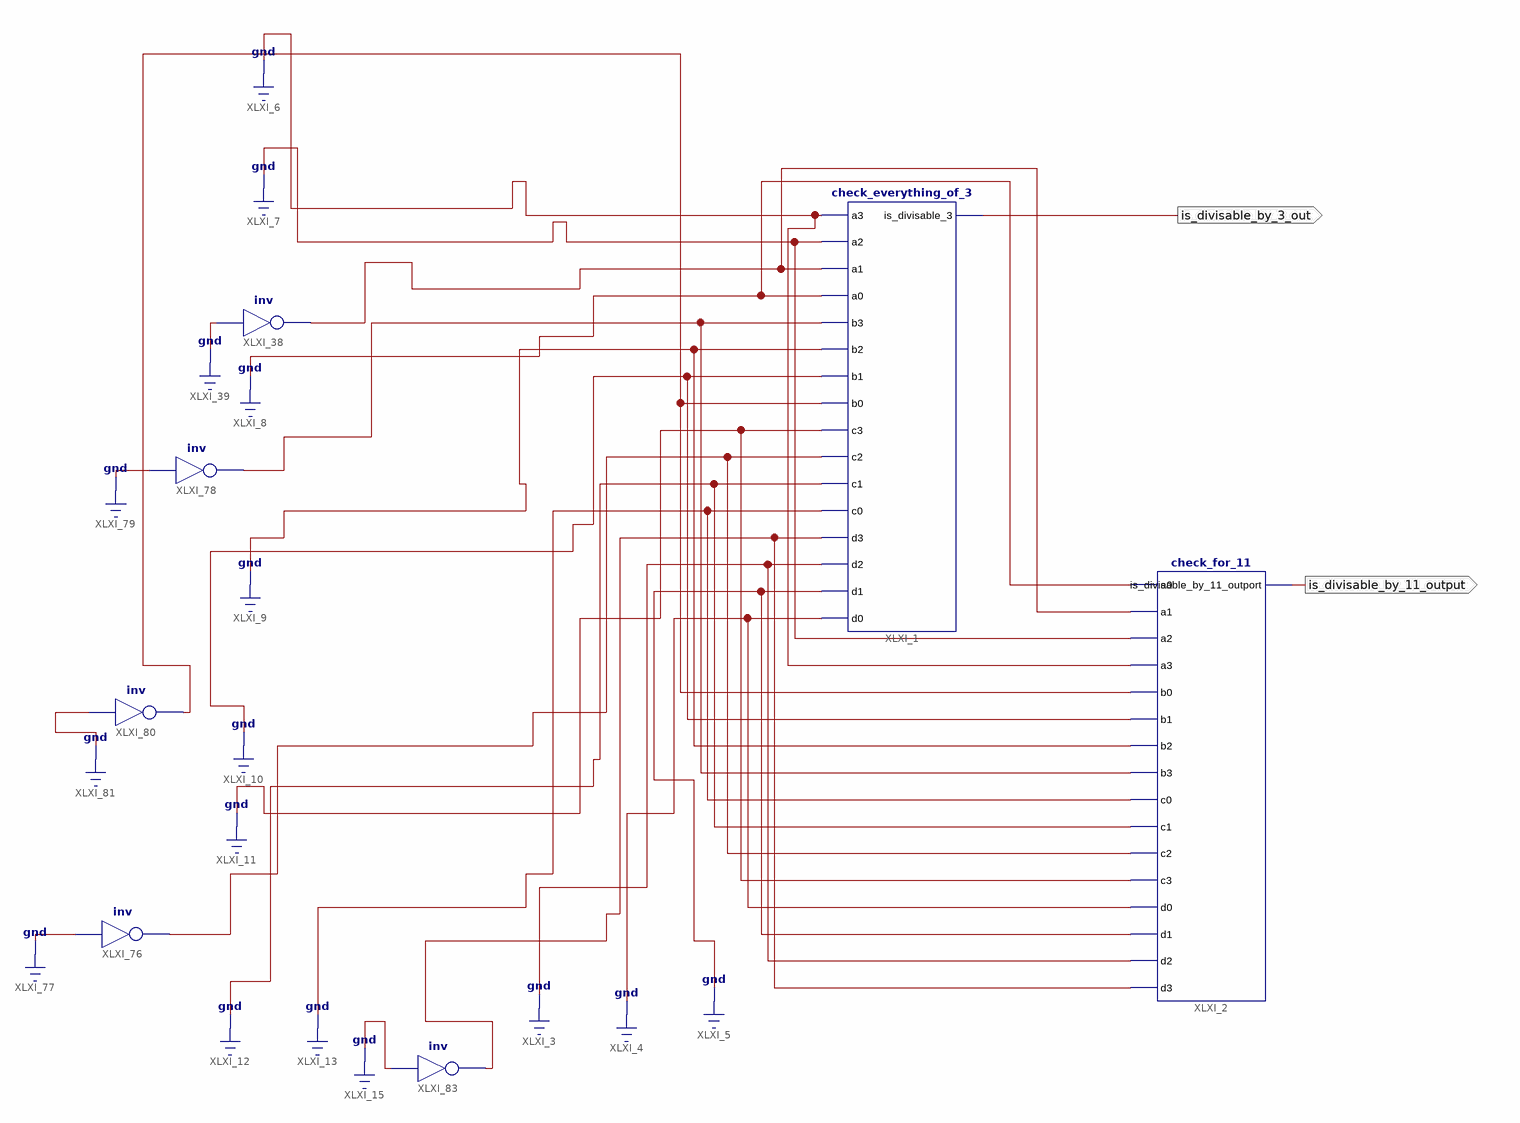
[diagram p0: schematic sheet 1]
// Xilinx ISE schematic bcd311.sch (spartan3adsp) as structural Verilog: 7 symbols, 2 ports
module bcd311 (
  output is_divisable_by_3_out,
  output is_divisable_by_11_output
);

  wire a1, b0, b3, c2, d3;

  check_everything_of_3 XLXI_1 (
    .a3(1'b0), .a2(1'b0), .a1(a1), .a0(1'b0), .b0(b0), .b1(1'b0), .b2(1'b0), .b3(b3), .c0(1'b0), .c1(1'b0),
    .c2(c2), .c3(1'b0), .d0(1'b0), .d1(1'b0), .d2(1'b0), .d3(d3), .is_divisable_3(is_divisable_by_3_out));
  check_for_11 XLXI_2 (
    .a0(1'b0), .a1(a1), .a2(1'b0), .a3(1'b0), .b0(b0), .b1(1'b0), .b2(1'b0), .b3(b3), .c0(1'b0), .c1(1'b0),
    .c2(c2), .c3(1'b0), .d0(1'b0), .d1(1'b0), .d2(1'b0), .d3(d3),
    .is_divisable_by_11_outport(is_divisable_by_11_output));
  not XLXI_38 (a1, 1'b0);
  not XLXI_76 (c2, 1'b0);
  not XLXI_78 (b3, 1'b0);
  not XLXI_80 (b0, 1'b0);
  not XLXI_83 (d3, 1'b0);
endmodule
